# EAGLE schematic Module 20200225_0_Traffic Light (EAGLE 9.3.2)
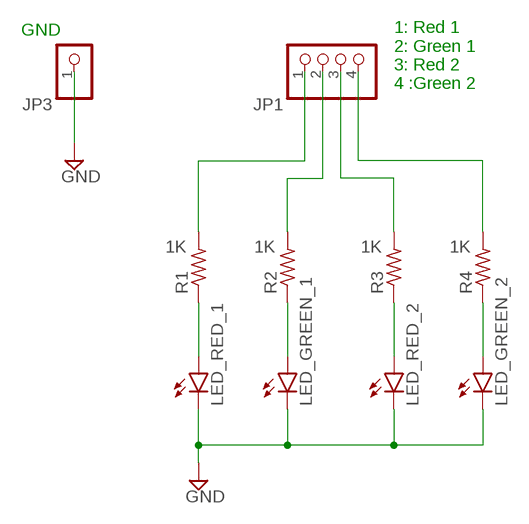
[diagram p0: schematic, sheet 1]

## Parts
JP1  PINHD-1X4  [1X04]
JP3  PINHD-1X1  [1X01]
LED_GREEN_1  LAP4-BOTTOM  [P47F-BOTTOM]
LED_GREEN_2  LAP4-BOTTOM  [P47F-BOTTOM]
LED_RED_1  LAP4-BOTTOM  [P47F-BOTTOM]
LED_RED_2  LAP4-BOTTOM  [P47F-BOTTOM]
R1  1K  R-US_0207/5V  [0207/5V]
R2  1K  R-US_0207/5V  [0207/5V]
R3  1K  R-US_0207/5V  [0207/5V]
R4  1K  R-US_0207/5V  [0207/5V]

## Nets
GND: JP3.1 LED_GREEN_1.C LED_GREEN_2.C LED_RED_1.C LED_RED_2.C
N$1: LED_RED_1.A R1.1
N$2: LED_GREEN_1.A R2.1
N$3: LED_RED_2.A R3.1
N$4: LED_GREEN_2.A R4.1
N$5: JP1.1 R1.2
N$6: JP1.2 R2.2
N$7: JP1.3 R3.2
N$8: JP1.4 R4.2

## Notes on the sheet
- GND
- 1: Red 1
  2: Green 1
  3: Red 2
  4 :Green 2

## Library data of the parts
JP1 = pinhead:PINHD-1X4: PIN HEADER
JP3 = pinhead:PINHD-1X1: PIN HEADER
LED_GREEN_1 LED_GREEN_2 LED_RED_1 LED_RED_2 = led:*P4: PointLED® Enhanced Thinfilm LED TOP & BOTTOM mount LS P47F, LR P47F, LA P47F, LY P47F, LT P4SG, LB P4SG, LW P4SG Source: http://catalog.osram-os.com .. LA_LR_LS_LY_P47F_Pb_free.pdf
R1-R4 = rcl:R-US_: RESISTOR, American symbol; SPICEPREFIX: R